# Altium schematic sheet clock.SchDoc
size A4
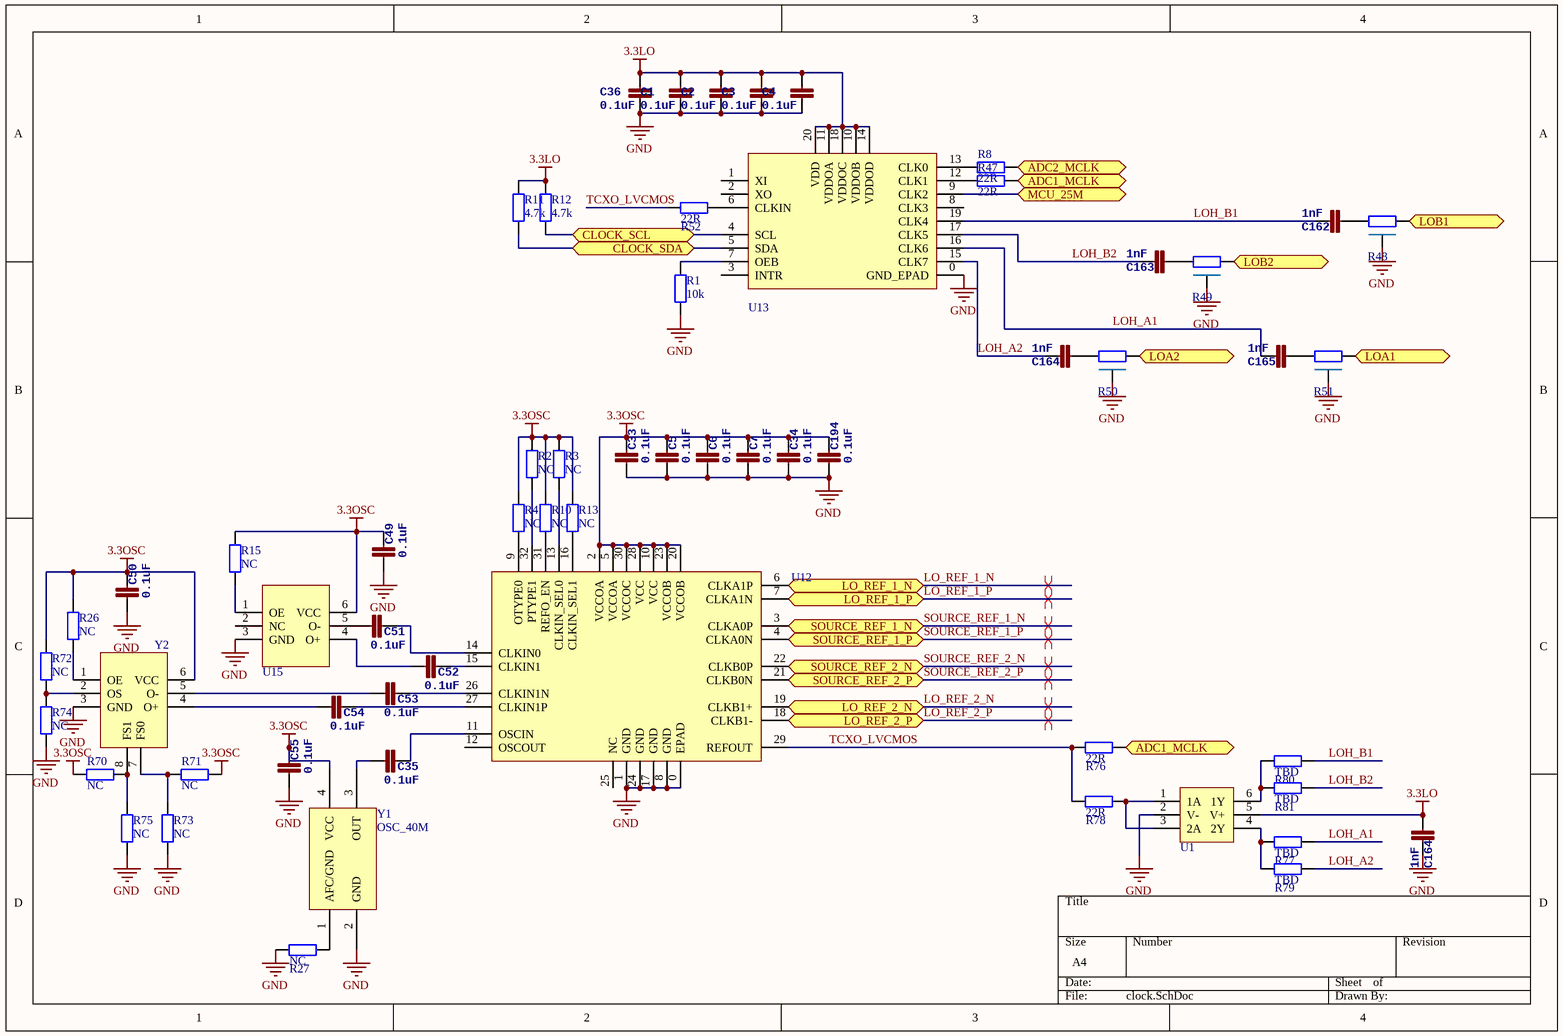
[diagram p0: clock.SchDoc]

## Parts
(Parts that share a designator on the sheet are numbered #1, #2 ... from top to bottom, then left to right.)
C1  0.1uF  [0402]
C2  0.1uF  [0402]
C3  0.1uF  [0402]
C4  0.1uF  [0402]
C5  0.1uF  [0402]
C6  0.1uF  [0402]
C7  0.1uF  [0402]
C33  0.1uF  [0402]
C34  0.1uF  [0402]
C35  0.1uF  [0402]
C36  0.1uF  [0402]
C49  0.1uF  [0402]
C50  0.1uF  [0402]
C51  0.1uF  [0402]
C52  0.1uF  [0402]
C53  0.1uF  [0402]
C54  0.1uF  [0402]
C55  0.1uF  [0402]
C162  1nF  [0402]
C163  1nF  [0402]
C164#1  1nF  [0402]
C164#2  1nF  [0402]
C165  1nF  [0402]
C194  0.1uF  [0402]
R1  10k  [0402]
R2  NC  [0402]
R3  NC  [0402]
R4  NC  [0402]
R8  22R  [0402]
R10  NC  [0402]
R11  4.7k  [0402]
R12  4.7k  [0402]
R13  NC  [0402]
R15  NC  [0402]
R26  NC  [0402]
R27  NC  [0402]
R47  22R  [0402]
R48  PiFilter  [PiFIiter]  (value not drawn)
R49  PiFilter  [PiFIiter]  (value not drawn)
R50  PiFilter  [PiFIiter]  (value not drawn)
R51  PiFilter  [PiFIiter]  (value not drawn)
R52  22R  [0402]
R70  NC  [0402]
R71  NC  [0402]
R72  NC  [0402]
R73  NC  [0402]
R74  NC  [0402]
R75  NC  [0402]
R76  22R  [0402]
R77  TBD  [0402]
R78  22R  [0402]
R79  TBD  [0402]
R80  TBD  [0402]
R81  TBD  [0402]
U1  74-2G04/14  [SOT23-6]  (value not drawn)
U12  LM00304-FUNC  [LMK00304]  (value not drawn)
U13  SI5351C  [si5351c]  (value not drawn)
U15  OSC_DIFF  [OSC3225_DIFF]  (value not drawn)
Y1  OSC_40M  [TXC_7Q]
Y2  OSC_DIFF_TI  [OSC7050-LMK61PD0A2]  (value not drawn)

## Ports
ADC1_MCLK, ADC2_MCLK, CLOCK_SCL, CLOCK_SDA, LO_REF_1_N, LO_REF_1_P, LO_REF_2_N, LO_REF_2_P, LOA1, LOA2, LOB1, LOB2, MCU_25M, SOURCE_REF_1_N, SOURCE_REF_1_P, SOURCE_REF_2_N, SOURCE_REF_2_P

## Nets
3.3LO: C1.2 C2.2 C3.2 C4.2 C36.2 C164#2.2 R11.1 R12.1 U1.5(V+) U13.10(VDDOB) U13.11(VDDOA) U13.14(VDDOD) U13.18(VDDOC) U13.20(VDD)
3.3OSC: C5.2 C6.2 C7.2 C33.2 C34.2 C49.2 C50.2 C55.2 C194.2 R2.1 R3.1 R4.1 R10.1 R13.1 R15.1 R26.1 R70.1 R71.2 R72.2 U12.2(VCCOA) U12.5(VCCOA) U12.10(VCC) U12.20(VCCOB) U12.23(VCCOB) U12.28(VCC) U12.30(VCCOC) U15.6(VCC) Y1.4(VCC) Y2.6(VCC)
GND: C1.1 C2.1 C3.1 C4.1 C5.1 C6.1 C7.1 C33.1 C34.1 C36.1 C49.1 C50.1 C55.1 C164#2.1 C194.1 R1.1 R27.2 R48.3 R49.3 R50.3 R51.3 R73.1 R74.1 R75.1 U1.2(V-) U12.0(EPAD) U12.1(GND) U12.8(GND) U12.17(GND) U12.24(GND) U13.0(GND_EPAD) U15.3(GND) Y1.2(GND) Y2.3(GND)
ADC1_MCLK: R47.2 R76.1 ; port ADC1_MCLK
ADC2_MCLK: R8.2 ; port ADC2_MCLK
CLOCK_SCL: R12.2 U13.4(SCL) ; port CLOCK_SCL
CLOCK_SDA: R11.2 U13.5(SDA) ; port CLOCK_SDA
LO_REF_1_N: U12.6(CLKA1P) ; port LO_REF_1_N
LO_REF_1_P: U12.7(CLKA1N) ; port LO_REF_1_P
LO_REF_2_N: U12.19(CLKB1+) ; port LO_REF_2_N
LO_REF_2_P: U12.18(CLKB1-) ; port LO_REF_2_P
LOA1: R51.1 ; port LOA1
LOA2: R50.1 ; port LOA2
LOB1: R48.2 ; port LOB1
LOB2: R49.2 ; port LOB2
LOH_A1: C165.1 R77.1 U13.16(CLK6)
LOH_A2: C164#1.1 R79.1 U13.15(CLK7)
LOH_B1: C162.1 R80.1 U13.19(CLK4)
LOH_B2: C163.1 R81.1 U13.17(CLK5)
MCU_25M: U13.9(CLK2) ; port MCU_25M
SOURCE_REF_1_N: U12.3(CLKA0P) ; port SOURCE_REF_1_N
SOURCE_REF_1_P: U12.4(CLKA0N) ; port SOURCE_REF_1_P
SOURCE_REF_2_N: U12.22(CLKB0P) ; port SOURCE_REF_2_N
SOURCE_REF_2_P: U12.21(CLKB0N) ; port SOURCE_REF_2_P
TCXO_LVCMOS: R52.2 R76.2 R78.2 U12.29(REFOUT)
NetC35_1: C35.1 Y1.3(OUT)
NetC35_2: C35.2 U12.11(OSCIN)
NetC51_1: C51.1 U15.5(O-)
NetC51_2: C51.2 U12.14(CLKIN0)
NetC52_1: C52.1 U15.4(O+)
NetC52_2: C52.2 U12.15(CLKIN1)
NetC53_1: C53.1 Y2.5(O-)
NetC53_2: C53.2 U12.26(CLKIN1N)
NetC54_1: C54.1 Y2.4(O+)
NetC54_2: C54.2 U12.27(CLKIN1P)
NetC162_2: C162.2 R48.1
NetC163_2: C163.2 R49.1
NetC164#1_2: C164#1.2 R50.2
NetC165_2: C165.2 R51.2
NetR1_2: R1.2 U13.7(OEB)
NetR2_2: R2.2 U12.32(PTYPE1)
NetR3_2: R3.2 U12.13(CLKIN_SEL0)
NetR4_2: R4.2 U12.9(OTYPE0)
NetR8_1: R8.1 U13.13(CLK0)
NetR10_2: R10.2 U12.31(REFO_EN)
NetR13_2: R13.2 U12.16(CLKIN_SEL1)
NetR15_2: R15.2 U15.1(OE)
NetR26_2: R26.2 Y2.1(OE)
NetR27_1: R27.1 Y1.1(AFC/GND)
NetR47_1: R47.1 U13.12(CLK1)
NetR52_1: R52.1 U13.6(CLKIN)
NetR70_2: R70.2 R75.2 Y2.8(FS1)
NetR71_1: R71.1 R73.2 Y2.7(FS0)
NetR72_1: R72.1 R74.2 Y2.2(OS)
NetR77_2: R77.2 R79.2 U1.4(2Y)
NetR78_1: R78.1 U1.1(1A) U1.3(2A)
NetR80_2: R80.2 R81.2 U1.6(1Y)

Not connected (* = marked no-connect by the designer): U12 12(OSCOUT) 25(NC); U13 1(XI) 2(XO) 3(INTR) 8(CLK3); U15 2(NC)

## Layout directives
differential pair: LO_REF_1_N, LO_REF_1_P, LO_REF_2_N, LO_REF_2_P, SOURCE_REF_1_N, SOURCE_REF_1_P, SOURCE_REF_2_N, SOURCE_REF_2_P

## Library data of the parts
C1-C7 C33-C36 C49-C55 C162 C163 C164#1 C164#2 C165 C194 = CAP0402-CAP: <b>Capacitor</b> / Standard 0603 ceramic capacitor, and 0.1" leaded capacitor.; PARTNO: CC0402ZRY5V7BB104
R1-R4 R8 R10-R13 R15 R26 R27 R47 R52 R70-R81 = Res2: Resistor
  R1 R8 R11 R12 R47 R52 R76-R81: Published: 8-Jun-2000; LatestRevisionDate: 17-Jul-2002; LatestRevisionNote: Re-released for DXP Platform.; PackageReference: AXIAL-0.4; Publisher: Altium Limited; PackageDescription: Axial Device, Thru-Hole; 2 Leads; 0.4 in Pin Spacing